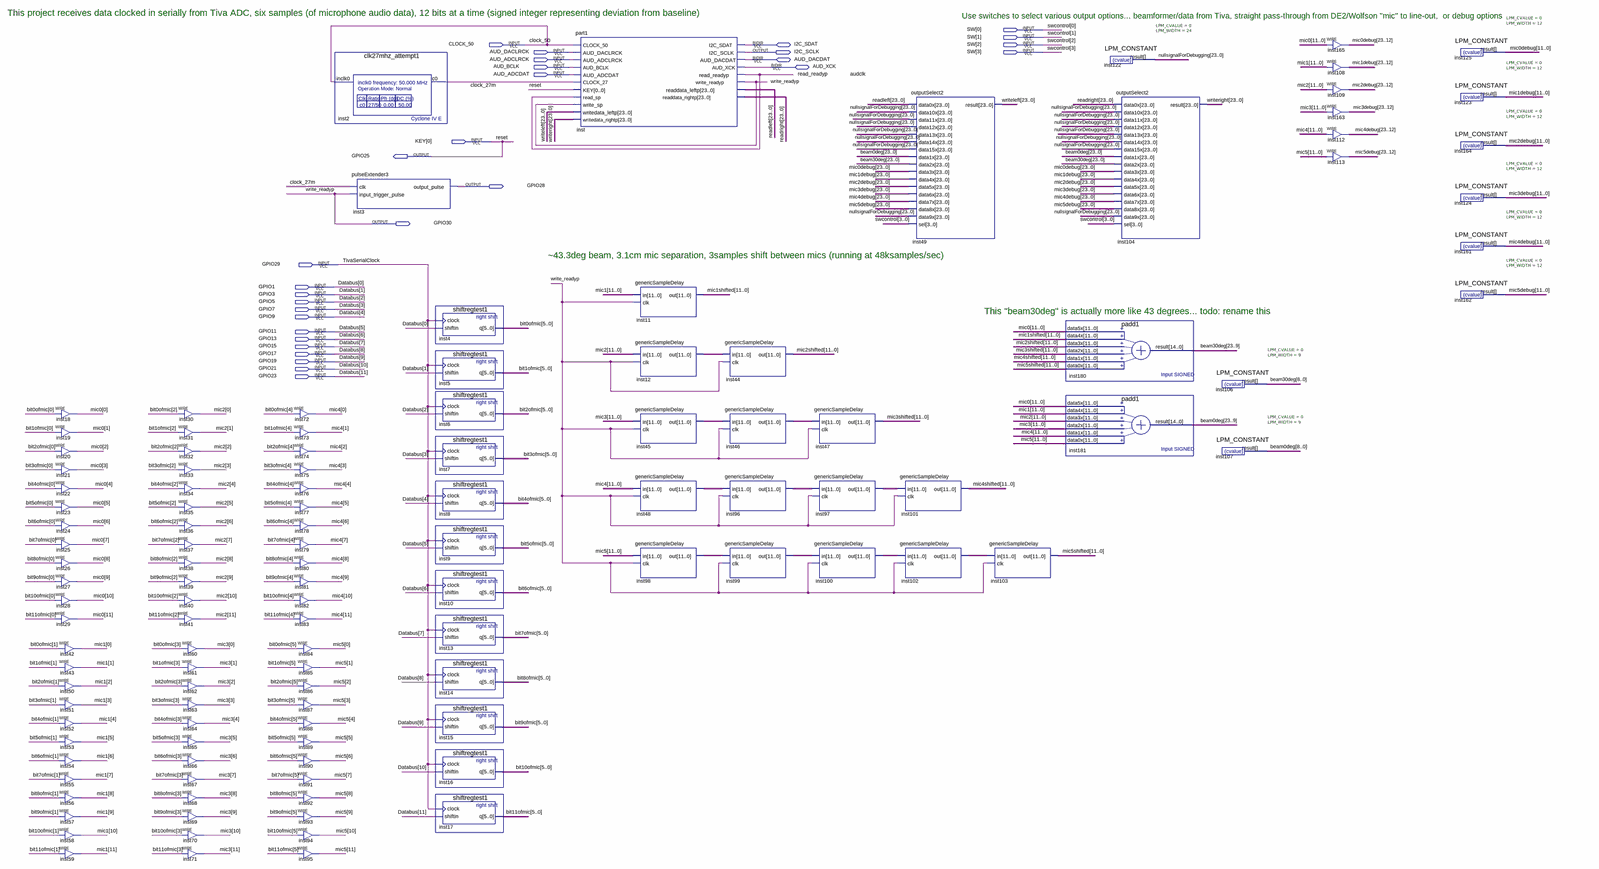
[diagram p0: schematic sheet, whole]
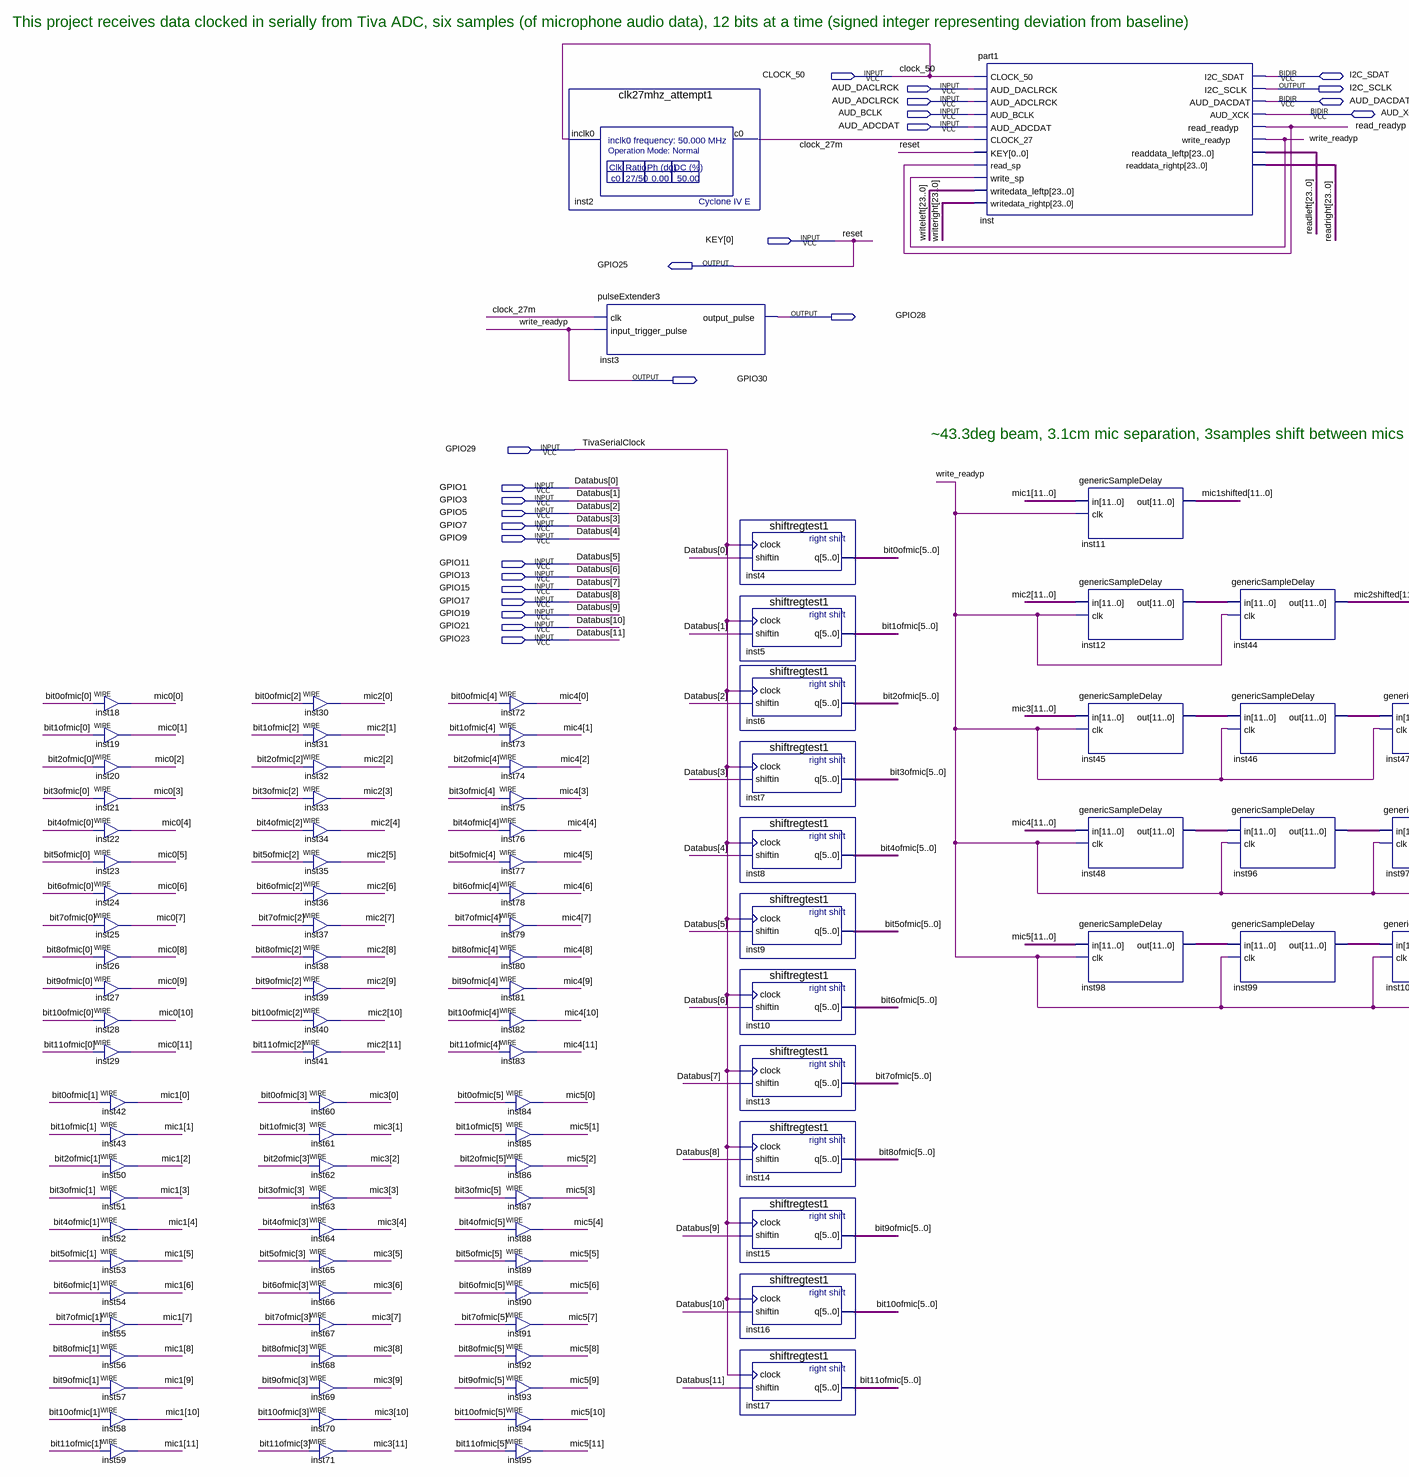
[diagram p1: schematic sheet, left part]
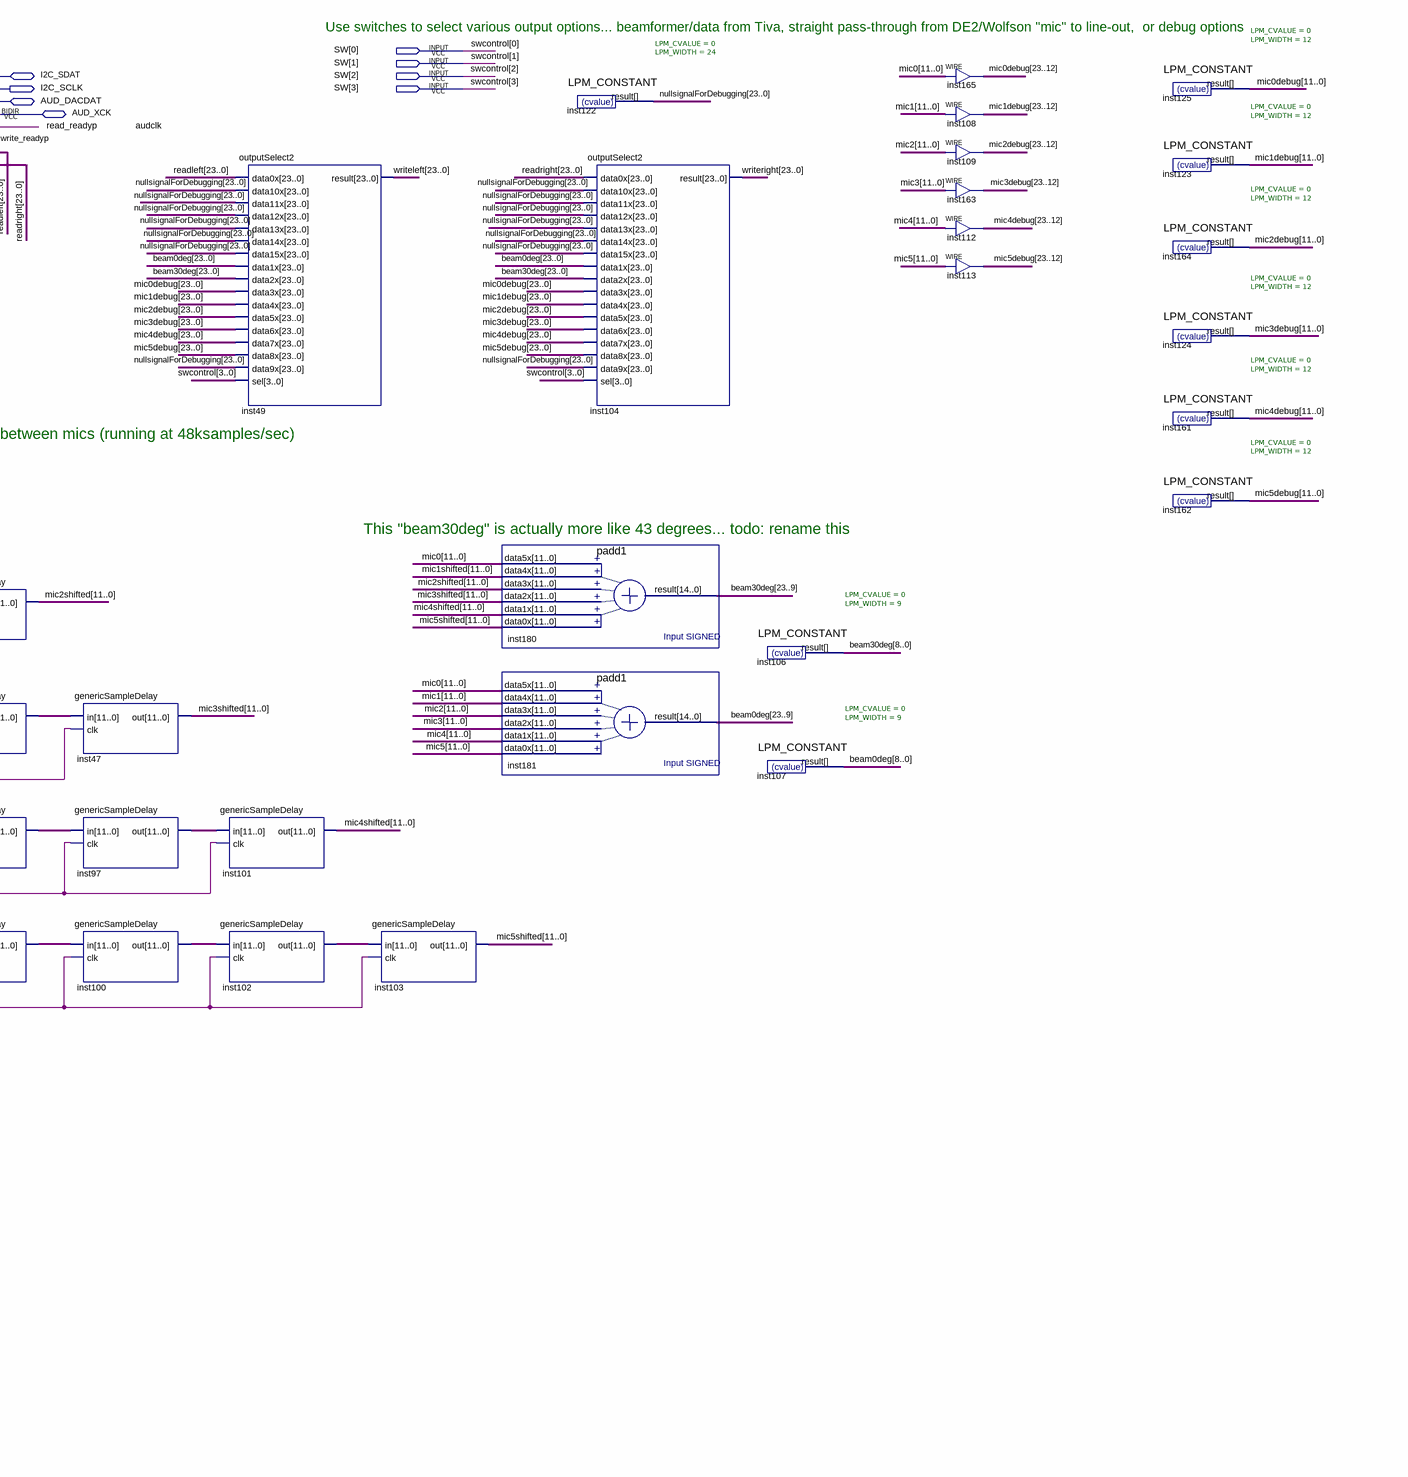
[diagram p2: schematic sheet, right part]
// Quartus schematic TivaTransfer3.bdf as structural Verilog: 121 symbols, 30 pins
module TivaTransfer3 (
  input  [3:0] SW,
  input  CLOCK_50,
  input  AUD_DACLRCK,
  input  AUD_ADCLRCK,
  input  AUD_BCLK,
  input  AUD_ADCDAT,
  input  [0:0] KEY,
  input  GPIO29,
  input  GPIO1,
  input  GPIO3,
  input  GPIO5,
  input  GPIO7,
  input  GPIO9,
  input  GPIO11,
  input  GPIO13,
  input  GPIO15,
  input  GPIO17,
  input  GPIO19,
  input  GPIO21,
  input  GPIO23,
  inout  I2C_SDAT,
  inout  AUD_DACDAT,
  inout  AUD_XCK,
  output I2C_SCLK,
  output GPIO25,
  output GPIO28,
  output GPIO30
);

  wire clock_27m, read_readyp;
  wire [5:0] bit0ofmic, bit1ofmic, bit2ofmic, bit3ofmic, bit4ofmic, bit5ofmic, bit6ofmic, bit7ofmic,
       bit8ofmic, bit9ofmic, bit10ofmic, bit11ofmic;
  wire [11:0] inst12_out, inst45_out, inst46_out, inst48_out, inst96_out, inst97_out, inst98_out, inst99_out,
       inst100_out, inst102_out, mic0, mic1, mic1shifted, mic2, mic2shifted, mic3, mic3shifted, mic4,
       mic4shifted, mic5, mic5shifted;
  wire [23:0] beam0deg, beam30deg, mic0debug, mic1debug, mic2debug, mic3debug, mic4debug, mic5debug,
       nullsignalForDebugging, readleft, readright, writeleft, writeright;

  assign mic0[0] = bit0ofmic[0];  // WIRE inst18
  assign mic0[1] = bit1ofmic[0];  // WIRE inst19
  assign mic0[2] = bit2ofmic[0];  // WIRE inst20
  assign mic0[3] = bit3ofmic[0];  // WIRE inst21
  assign mic0[4] = bit4ofmic[0];  // WIRE inst22
  assign mic0[5] = bit5ofmic[0];  // WIRE inst23
  assign mic0[6] = bit6ofmic[0];  // WIRE inst24
  assign mic0[7] = bit7ofmic[0];  // WIRE inst25
  assign mic0[8] = bit8ofmic[0];  // WIRE inst26
  assign mic0[9] = bit9ofmic[0];  // WIRE inst27
  assign mic0[10] = bit10ofmic[0];  // WIRE inst28
  assign mic0[11] = bit11ofmic[0];  // WIRE inst29
  assign mic1[0] = bit0ofmic[1];  // WIRE inst42
  assign mic1[1] = bit1ofmic[1];  // WIRE inst43
  assign mic1[2] = bit2ofmic[1];  // WIRE inst50
  assign mic1[3] = bit3ofmic[1];  // WIRE inst51
  assign mic1[4] = bit4ofmic[1];  // WIRE inst52
  assign mic1[5] = bit5ofmic[1];  // WIRE inst53
  assign mic1[6] = bit6ofmic[1];  // WIRE inst54
  assign mic1[7] = bit7ofmic[1];  // WIRE inst55
  assign mic1[8] = bit8ofmic[1];  // WIRE inst56
  assign mic1[9] = bit9ofmic[1];  // WIRE inst57
  assign mic1[10] = bit10ofmic[1];  // WIRE inst58
  assign mic1[11] = bit11ofmic[1];  // WIRE inst59
  assign mic2[0] = bit0ofmic[2];  // WIRE inst30
  assign mic2[1] = bit1ofmic[2];  // WIRE inst31
  assign mic2[2] = bit2ofmic[2];  // WIRE inst32
  assign mic2[3] = bit3ofmic[2];  // WIRE inst33
  assign mic2[4] = bit4ofmic[2];  // WIRE inst34
  assign mic2[5] = bit5ofmic[2];  // WIRE inst35
  assign mic2[6] = bit6ofmic[2];  // WIRE inst36
  assign mic2[7] = bit7ofmic[2];  // WIRE inst37
  assign mic2[8] = bit8ofmic[2];  // WIRE inst38
  assign mic2[9] = bit9ofmic[2];  // WIRE inst39
  assign mic2[10] = bit10ofmic[2];  // WIRE inst40
  assign mic2[11] = bit11ofmic[2];  // WIRE inst41
  assign mic3[0] = bit0ofmic[3];  // WIRE inst60
  assign mic3[1] = bit1ofmic[3];  // WIRE inst61
  assign mic3[2] = bit2ofmic[3];  // WIRE inst62
  assign mic3[3] = bit3ofmic[3];  // WIRE inst63
  assign mic3[4] = bit4ofmic[3];  // WIRE inst64
  assign mic3[5] = bit5ofmic[3];  // WIRE inst65
  assign mic3[6] = bit6ofmic[3];  // WIRE inst66
  assign mic3[7] = bit7ofmic[3];  // WIRE inst67
  assign mic3[8] = bit8ofmic[3];  // WIRE inst68
  assign mic3[9] = bit9ofmic[3];  // WIRE inst69
  assign mic3[10] = bit10ofmic[3];  // WIRE inst70
  assign mic3[11] = bit11ofmic[3];  // WIRE inst71
  assign mic4[0] = bit0ofmic[4];  // WIRE inst72
  assign mic4[1] = bit1ofmic[4];  // WIRE inst73
  assign mic4[2] = bit2ofmic[4];  // WIRE inst74
  assign mic4[3] = bit3ofmic[4];  // WIRE inst75
  assign mic4[4] = bit4ofmic[4];  // WIRE inst76
  assign mic4[5] = bit5ofmic[4];  // WIRE inst77
  assign mic4[6] = bit6ofmic[4];  // WIRE inst78
  assign mic4[7] = bit7ofmic[4];  // WIRE inst79
  assign mic4[8] = bit8ofmic[4];  // WIRE inst80
  assign mic4[9] = bit9ofmic[4];  // WIRE inst81
  assign mic4[10] = bit10ofmic[4];  // WIRE inst82
  assign mic4[11] = bit11ofmic[4];  // WIRE inst83
  assign mic5[0] = bit0ofmic[5];  // WIRE inst84
  assign mic5[1] = bit1ofmic[5];  // WIRE inst85
  assign mic5[2] = bit2ofmic[5];  // WIRE inst86
  assign mic5[3] = bit3ofmic[5];  // WIRE inst87
  assign mic5[4] = bit4ofmic[5];  // WIRE inst88
  assign mic5[5] = bit5ofmic[5];  // WIRE inst89
  assign mic5[6] = bit6ofmic[5];  // WIRE inst90
  assign mic5[7] = bit7ofmic[5];  // WIRE inst91
  assign mic5[8] = bit8ofmic[5];  // WIRE inst92
  assign mic5[9] = bit9ofmic[5];  // WIRE inst93
  assign mic5[10] = bit10ofmic[5];  // WIRE inst94
  assign mic5[11] = bit11ofmic[5];  // WIRE inst95
  clk27mhz_attempt1 inst2 (.inclk0(CLOCK_50), .c0(clock_27m));
  pulseExtender3 inst3 (.clk(clock_27m), .input_trigger_pulse(GPIO30), .output_pulse(GPIO28));
  shiftregtest1 inst4 (.clock(GPIO29), .shiftin(GPIO1), .q(bit0ofmic));
  shiftregtest1 inst5 (.clock(GPIO29), .shiftin(GPIO3), .q(bit1ofmic));
  shiftregtest1 inst6 (.clock(GPIO29), .shiftin(GPIO5), .q(bit2ofmic));
  shiftregtest1 inst7 (.clock(GPIO29), .shiftin(GPIO7), .q(bit3ofmic));
  shiftregtest1 inst8 (.clock(GPIO29), .shiftin(GPIO9), .q(bit4ofmic));
  shiftregtest1 inst9 (.clock(GPIO29), .shiftin(GPIO11), .q(bit5ofmic));
  shiftregtest1 inst10 (.clock(GPIO29), .shiftin(GPIO13), .q(bit6ofmic));
  shiftregtest1 inst13 (.clock(GPIO29), .shiftin(GPIO15), .q(bit7ofmic));
  shiftregtest1 inst14 (.clock(GPIO29), .shiftin(GPIO17), .q(bit8ofmic));
  shiftregtest1 inst15 (.clock(GPIO29), .shiftin(GPIO19), .q(bit9ofmic));
  shiftregtest1 inst16 (.clock(GPIO29), .shiftin(GPIO21), .q(bit10ofmic));
  shiftregtest1 inst17 (.clock(GPIO29), .shiftin(GPIO23), .q(bit11ofmic));
  part1 inst (
    .CLOCK_50(CLOCK_50), .AUD_DACLRCK(AUD_DACLRCK), .AUD_ADCLRCK(AUD_ADCLRCK), .AUD_BCLK(AUD_BCLK),
    .AUD_ADCDAT(AUD_ADCDAT), .CLOCK_27(clock_27m), .KEY(KEY[0]), .read_sp(read_readyp), .write_sp(GPIO30),
    .writedata_leftp(writeleft), .writedata_rightp(writeright), .I2C_SCLK(I2C_SCLK), .AUD_DACDAT(AUD_DACDAT),
    .AUD_XCK(AUD_XCK), .read_readyp(read_readyp), .write_readyp(GPIO30), .readdata_leftp(readleft),
    .readdata_rightp(readright), .I2C_SDAT(I2C_SDAT));
  genericSampleDelay inst11 (.in(mic1), .clk(GPIO30), .out(mic1shifted));
  genericSampleDelay inst12 (.in(mic2), .clk(GPIO30), .out(inst12_out));
  genericSampleDelay inst45 (.in(mic3), .clk(GPIO30), .out(inst45_out));
  genericSampleDelay inst48 (.in(mic4), .clk(GPIO30), .out(inst48_out));
  genericSampleDelay inst98 (.in(mic5), .clk(GPIO30), .out(inst98_out));
  genericSampleDelay inst44 (.in(inst12_out), .clk(GPIO30), .out(mic2shifted));
  genericSampleDelay inst46 (.in(inst45_out), .clk(GPIO30), .out(inst46_out));
  genericSampleDelay inst96 (.in(inst48_out), .clk(GPIO30), .out(inst96_out));
  genericSampleDelay inst99 (.in(inst98_out), .clk(GPIO30), .out(inst99_out));
  genericSampleDelay inst47 (.in(inst46_out), .clk(GPIO30), .out(mic3shifted));
  genericSampleDelay inst97 (.in(inst96_out), .clk(GPIO30), .out(inst97_out));
  genericSampleDelay inst100 (.in(inst99_out), .clk(GPIO30), .out(inst100_out));
  outputSelect2 inst49 (
    .data0x(readleft), .data10x(nullsignalForDebugging), .data11x(nullsignalForDebugging),
    .data12x(nullsignalForDebugging), .data13x(nullsignalForDebugging), .data14x(nullsignalForDebugging),
    .data15x(nullsignalForDebugging), .data1x(beam0deg), .data2x(beam30deg), .data3x(mic0debug),
    .data4x(mic1debug), .data5x(mic2debug), .data6x(mic3debug), .data7x(mic4debug), .data8x(mic5debug),
    .data9x(nullsignalForDebugging), .sel(SW), .result(writeleft));
  genericSampleDelay inst101 (.in(inst97_out), .clk(GPIO30), .out(mic4shifted));
  genericSampleDelay inst102 (.in(inst100_out), .clk(GPIO30), .out(inst102_out));
  genericSampleDelay inst103 (.in(inst102_out), .clk(GPIO30), .out(mic5shifted));
  padd1 inst180 (
    .data5x(mic0), .data4x(mic1shifted), .data3x(mic2shifted), .data2x(mic3shifted), .data1x(mic4shifted),
    .data0x(mic5shifted), .result(beam30deg[23:9]));
  padd1 inst181 (
    .data5x(mic0), .data4x(mic1), .data3x(mic2), .data2x(mic3), .data1x(mic4), .data0x(mic5),
    .result(beam0deg[23:9]));
  LPM_CONSTANT #(.LPM_CVALUE(0), .LPM_WIDTH(24)) inst122 (.result(nullsignalForDebugging));
  outputSelect2 inst104 (
    .data0x(readright), .data10x(nullsignalForDebugging), .data11x(nullsignalForDebugging),
    .data12x(nullsignalForDebugging), .data13x(nullsignalForDebugging), .data14x(nullsignalForDebugging),
    .data15x(nullsignalForDebugging), .data1x(beam0deg), .data2x(beam30deg), .data3x(mic0debug),
    .data4x(mic1debug), .data5x(mic2debug), .data6x(mic3debug), .data7x(mic4debug), .data8x(mic5debug),
    .data9x(nullsignalForDebugging), .sel(SW), .result(writeright));
  LPM_CONSTANT #(.LPM_CVALUE(0), .LPM_WIDTH(9)) inst106 (.result(beam30deg[8:0]));
  LPM_CONSTANT #(.LPM_CVALUE(0), .LPM_WIDTH(9)) inst107 (.result(beam0deg[8:0]));
  assign mic0debug[23:12] = mic0;  // WIRE inst165
  assign mic1debug[23:12] = mic1;  // WIRE inst108
  assign mic2debug[23:12] = mic2;  // WIRE inst109
  assign mic3debug[23:12] = mic3;  // WIRE inst163
  assign mic4debug[23:12] = mic4;  // WIRE inst112
  assign mic5debug[23:12] = mic5;  // WIRE inst113
  LPM_CONSTANT #(.LPM_CVALUE(0), .LPM_WIDTH(12)) inst125 (.result(mic0debug[11:0]));
  LPM_CONSTANT #(.LPM_CVALUE(0), .LPM_WIDTH(12)) inst123 (.result(mic1debug[11:0]));
  LPM_CONSTANT #(.LPM_CVALUE(0), .LPM_WIDTH(12)) inst164 (.result(mic2debug[11:0]));
  LPM_CONSTANT #(.LPM_CVALUE(0), .LPM_WIDTH(12)) inst124 (.result(mic3debug[11:0]));
  LPM_CONSTANT #(.LPM_CVALUE(0), .LPM_WIDTH(12)) inst161 (.result(mic4debug[11:0]));
  LPM_CONSTANT #(.LPM_CVALUE(0), .LPM_WIDTH(12)) inst162 (.result(mic5debug[11:0]));

  assign GPIO25 = KEY[0];

  // Other names for the same wires on the sheet: audclk = AUD_XCK;
  //   Databus[11:0] = {GPIO23, GPIO21, GPIO19, GPIO17, GPIO15, GPIO13, GPIO11, GPIO9, GPIO7, GPIO5, GPIO3, GPIO1};
  //   reset = KEY[0]; swcontrol[3:0] = SW; TivaSerialClock = GPIO29; write_readyp = GPIO30

  // Notes on the sheet:
  //   This project receives data clocked in serially from Tiva ADC, six samples (of microphone audio data), 12 bits at a time (signed integer representing deviation from baseline)
  //   Use switches to select various output options... beamformer/data from Tiva, straight pass-through from DE2/Wolfson "mic" to line-out,  or debug options
  //   ~43.3deg beam, 3.1cm mic separation, 3samples shift between mics (running at 48ksamples/sec)
  //   This "beam30deg" is actually more like 43 degrees... todo: rename this
endmodule
